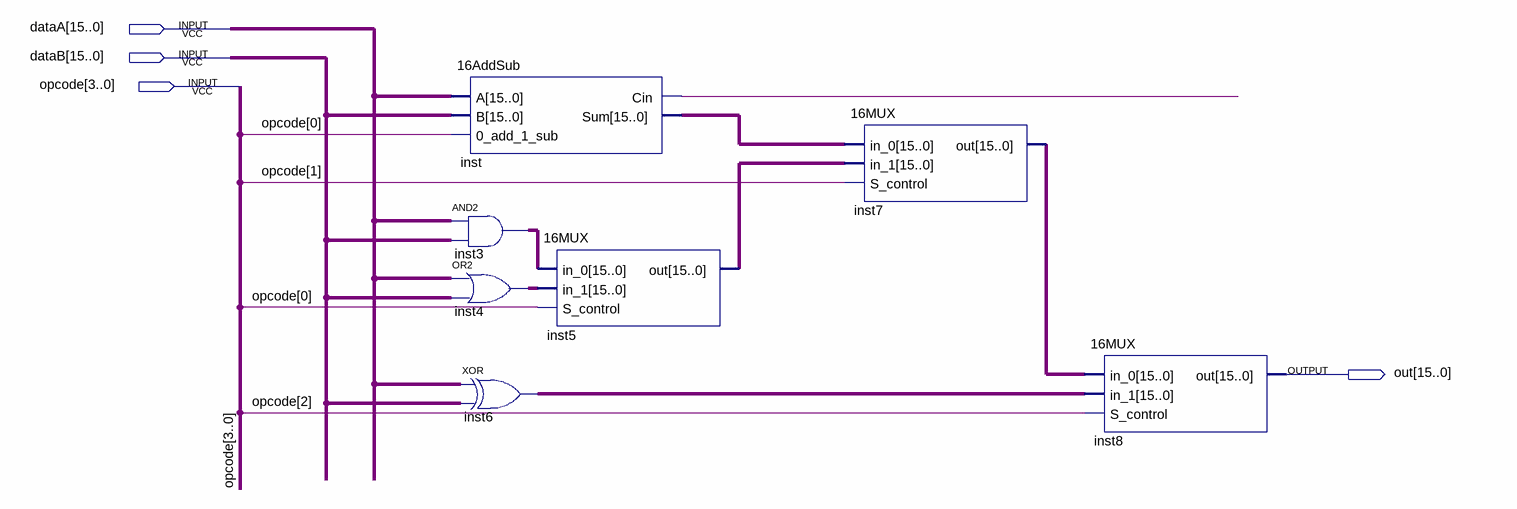
[diagram p0: schematic sheet]
// Quartus schematic ALU.bdf as structural Verilog: 7 symbols, 4 pins
module ALU (
  input  [15:0] dataA,
  input  [15:0] dataB,
  input  [3:0] opcode,
  output [15:0] out
);

  wire inst_cin;
  wire [15:0] inst3_out, inst4_out, inst5_out, inst6_out, inst7_out, inst_sum;

  \16AddSub  inst (.A(dataA), .B(dataB), .\0_add_1_sub (opcode[0]), .Cin(inst_cin), .Sum(inst_sum));
  assign inst3_out = dataA & dataB;  // AND2 inst3, 16 bits wide
  assign inst4_out = dataA | dataB;  // OR2 inst4, 16 bits wide
  assign inst6_out = dataA ^ dataB;  // XOR inst6, 16 bits wide
  \16MUX  inst5 (.in_0(inst3_out), .in_1(inst4_out), .S_control(opcode[0]), .out(inst5_out));
  \16MUX  inst7 (.in_0(inst_sum), .in_1(inst5_out), .S_control(opcode[1]), .out(inst7_out));
  \16MUX  inst8 (.in_0(inst7_out), .in_1(inst6_out), .S_control(opcode[2]), .out(out));
endmodule
